# Altium schematic sheet Sheet2.SchDoc
size A; SheetNumber: 1; SheetTotal: 1
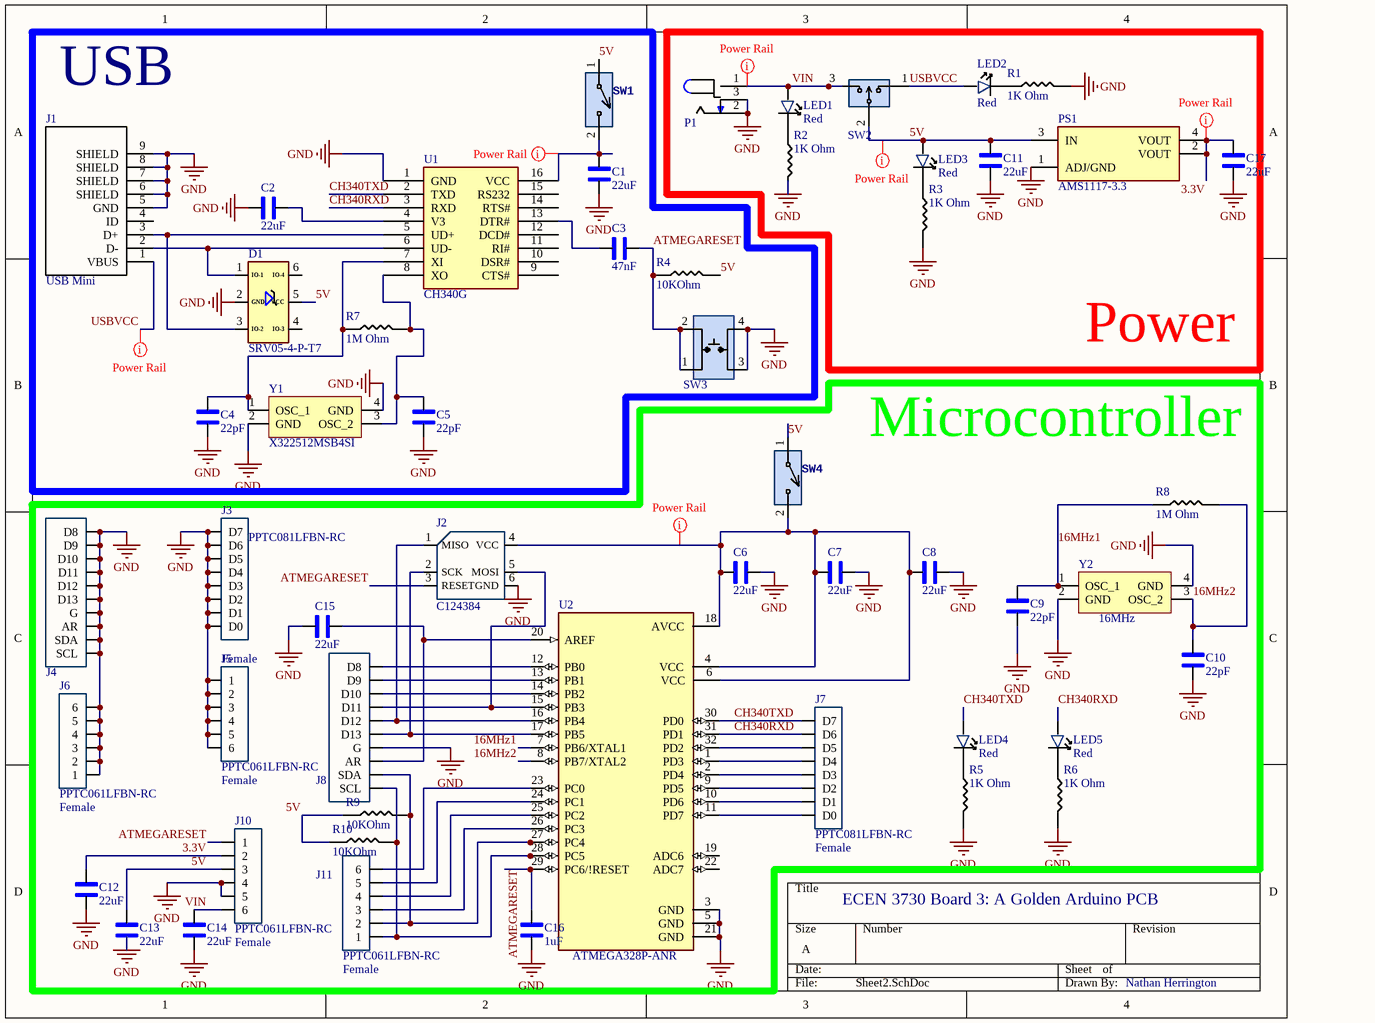
[diagram p0: Sheet2.SchDoc]

## Parts
C1  22uF  [1206_Passive_Capacitor]
C2  22uF  [1206_Passive_Capacitor]
C3  47nF  [1206_Passive_Capacitor]
C4  22pF  [1206_Passive_Capacitor]
C5  22pF  [1206_Passive_Capacitor]
C6  22uF  [1206_Passive_Capacitor]
C7  22uF  [1206_Passive_Capacitor]
C8  22uF  [1206_Passive_Capacitor]
C9  22pF  [1206_Passive_Capacitor]
C10  22pF  [1206_Passive_Capacitor]
C11  22uF  [1206_Passive_Capacitor]
C12  22uF  [1206_Passive_Capacitor]
C13  22uF  [1206_Passive_Capacitor]
C14  22uF  [1206_Passive_Capacitor]
C15  22uF  [1206_Passive_Capacitor]
C16  1uF  [1206_Passive_Capacitor]
C17  22uF  [1206_Passive_Capacitor]
D1  SRV05-4-P-T7  [TVS]
J1  USB Mini  [USB_MINI_B]
J2  LCSC Part#: C124384  [ICSP]  (hidden comment: NRPN032PAEN-RC)
J3  PPTC081LFBN-RC  value Female  [8_PIN_ARD-DIG_100MIL]
J4  PPTC101LFBN-RC  [10_PIN_ARDUINO_100MIL]  (value not drawn)
J5  PPTC061LFBN-RC  value Female  [6_PIN_100MIL -Female]
J6  PPTC061LFBN-RC  value Female  [6_PIN_100MIL -Female]
J7  PPTC081LFBN-RC  value Female  [8_PIN_ARD-DIG_100MIL]
J8  PPTC101LFBN-RC  [10_PIN_ARDUINO_100MIL]  (value not drawn)
J10  PPTC061LFBN-RC  value Female  [6_PIN_100MIL -Female]
J11  PPTC061LFBN-RC  value Female  [6_PIN_100MIL -Female]
LED1  Red  [LED_1206]
LED2  Red  [LED_1206]
LED3  Red  [LED_1206]
LED4  Red  [LED_1206]
LED5  Red  [LED_1206]
P1  Power Jack  [Power_Jack]  (value not drawn)
PS1  AMS1117-3.3  [LDO]
R1  value 1K Ohm  [1206_Passive_Resitor]  (hidden comment: 1k)
R2  value 1K Ohm  [1206_Passive_Resitor]  (hidden comment: 1k)
R3  value 1K Ohm  [1206_Passive_Resitor]  (hidden comment: 1k)
R4  value 10KOhm  [1206_Passive_Resitor]  (hidden comment: 10k)
R5  value 1K Ohm  [1206_Passive_Resitor]  (hidden comment: 1k)
R6  value 1K Ohm  [1206_Passive_Resitor]  (hidden comment: 1k)
R7  value 1M Ohm  [1206_Passive_Resitor]  (hidden comment: 1M)
R8  value 1M Ohm  [1206_Passive_Resitor]  (hidden comment: 1M)
R9  value 10KOhm  [1206_Passive_Resitor]  (hidden comment: 10k)
R10  value 10KOhm  [1206_Passive_Resitor]  (hidden comment: 10k)
SW1  SW_2Pin_100mil_Switch  [2Pin-Header-Conn]  (value not drawn)
SW2  PREC003SAAN-RC  [3_PIN_100mil]  (value not drawn)
SW3  TL3305AF160QG  [Switch_JLC]  (value not drawn)
SW4  SW_2Pin_100mil_Switch  [2Pin-Header-Conn]  (value not drawn)
U1  CH340G  [USB to serial]
U2  ATMEGA328P-ANR  [ATMega328P]
Y1  X322512MSB4SI  [Crystal resonator]
Y2  value 16MHz  [Crystal resonator]  (hidden comment: X322516MLB4SI)

## Blocks framed on the sheet
USB: C1-C5 D1 J1 R4 R7 SW1 SW3 U1 Y1
Power: C11 C17 LED1-LED3 P1 PS1 R1-R3 SW2
Microcontroller: C6-C10 C12-C16 J2-J8 J10 J11 LED4 LED5 R5 R6 R8-R10 SW4 U2 Y2

## Nets
GND: C1.2 C2.1 C4.1 C5.1 C6.2 C7.2 C8.2 C9.2 C10.2 C11.1 C12.2 C13.2 C14.1 C15.1 C16.2 C17.1 D1.2(GND) J1.5(GND) J1.6(SHIELD) J1.7(SHIELD) J1.8(SHIELD) J1.9(SHIELD) J2.6(GND) J3.1(D7) J3.2(D6) J3.3(D5) J3.4(D4) J3.5(D3) J3.6(D2) J3.7(D1) J3.8(D0) J4.1(SCL) J4.2(SDA) J4.3(AR) J4.4(G) J4.5(D13) J4.6(D12) J4.7(D11) J4.8(D10) J4.9(D9) J4.10(D8) J5.1 J5.2 J5.3 J5.4 J5.5 J5.6 J6.1 J6.2 J6.3 J6.4 J6.5 J6.6 J8.4(G) J10.4 J10.5 P1.2 P1.3 PS1.1(ADJ/GND) R1.2 R2.2 R3.2 R5.2 R6.2 SW3.3 SW3.4 U1.1(GND) U2.3(GND) U2.5(GND) U2.21(GND) Y1.2(GND) Y1.4(GND) Y2.2(GND) Y2.4(GND)
3.3V: C12.1 C17.2 J10.2 PS1.2(VOUT) PS1.4(VOUT)
5V: C11.2 C13.1 D1.5(VCC) J10.3 LED3.1 PS1.3(IN) R4.2 R9.1 R10.1 SW1.1 SW2.2 SW4.1
16MHz1: C9.1 R8.1 U2.7(PB6/XTAL1) Y2.1(OSC_1)
16MHz2: C10.1 R8.2 U2.8(PB7/XTAL2) Y2.3(OSC_2)
ATMEGARESET: C3.2 C16.1 J2.3(RESET) J10.1 R4.1 SW3.1 SW3.2 U2.29(PC6/!RESET)
CH340RXD: J7.2(D6) LED5.1 U1.3(RXD) U2.31(PD1)
CH340TXD: J7.1(D7) LED4.1 U1.2(TXD) U2.30(PD0)
USBVCC: J1.1(VBUS) LED2.1 SW2.1
VIN: C14.2 J10.6 LED1.1 P1.1 SW2.3
NetC1_1: C1.1 SW1.2 U1.16(VCC)
NetC2_2: C2.2 U1.4(V3)
NetC3_1: C3.1 U1.13(DTR#)
NetC4_2: C4.2 R7.1 U1.7(XI) Y1.1(OSC_1)
NetC5_2: C5.2 R7.2 U1.8(XO) Y1.3(OSC_2)
NetC6_1: C6.1 C7.1 C8.1 J2.4(VCC) SW4.2 U2.4(VCC) U2.6(VCC) U2.18(AVCC)
NetC15_2: C15.2 J8.3(AR) U2.20(AREF)
NetD1_1: D1.1(IO-1) J1.2(D-) U1.6(UD-)
NetD1_3: D1.3(IO-2) J1.3(D+) U1.5(UD+)
NetJ2_1: J2.1(MISO) J8.6(D12) U2.16(PB4)
NetJ2_2: J2.2(SCK) J8.5(D13) U2.17(PB5)
NetJ2_5: J2.5(MOSI) J8.7(D11) U2.15(PB3)
NetJ7_3: J7.3(D5) U2.32(PD2)
NetJ7_4: J7.4(D4) U2.1(PD3)
NetJ7_5: J7.5(D3) U2.2(PD4)
NetJ7_6: J7.6(D2) U2.9(PD5)
NetJ7_7: J7.7(D1) U2.10(PD6)
NetJ7_8: J7.8(D0) U2.11(PD7)
NetJ8_1: J8.1(SCL) J11.1 R10.2 U2.28(PC5)
NetJ8_2: J8.2(SDA) J11.2 R9.2 U2.27(PC4)
NetJ8_8: J8.8(D10) U2.14(PB2)
NetJ8_9: J8.9(D9) U2.13(PB1)
NetJ8_10: J8.10(D8) U2.12(PB0)
NetJ11_3: J11.3 U2.26(PC3)
NetJ11_4: J11.4 U2.25(PC2)
NetJ11_5: J11.5 U2.24(PC1)
NetJ11_6: J11.6 U2.23(PC0)
NetLED1_2: LED1.2 R2.1
NetLED2_2: LED2.2 R1.1
NetLED3_2: LED3.2 R3.1
NetLED4_2: LED4.2 R5.1
NetLED5_2: LED5.2 R6.1

Not connected (* = marked no-connect by the designer): D1 4(IO-3) 6(IO-4); J1 4(ID); U1 9(CTS#) 10(DSR#) 11(RI#) 12(DCD#) 14(RTS#) 15(RS232); U2 19(ADC6) 22(ADC7)

## Layout directives
rule Width Constraint [Pref Width = 20mil    Min Width = 20mil    Max Width = 100mil]: 3.3V, 5V, NetC1_1, NetC6_1, USBVCC, VIN

## Notes on the sheet
- ECEN 3730 Board 3: A Golden Arduino PCB
- Nathan Herrington

## Library data of the parts
C1 C2 C6-C8 C11-C15 C17 = C_22uF_1206: 22uF ±10% 25V X5R 1206 Multilayer Ceramic Capacitors MLCC - SMD/SMT RoHS; MFR Part #: CL31A226KAHNNNE; Type: basic; LCSC Part#: C12891; Datasheet: https://datasheet.lcsc.com/lcsc/1811031514_Samsung-Electro-Mechanics-CL31A226KAHNNNE_C12891.pdf; Value: 22uF
C3 = C_47nF_1206: 47nF ±5% 50V C0G 1206 Multilayer Ceramic Capacitors MLCC - SMD/SMT RoHS; MFR Part #: GRM31M5C1H473JA01L; Type: Extended; LCSC Part#: C21812; Datasheet: https://datasheet.lcsc.com/lcsc/1810201313_Murata-Electronics-GRM31M5C1H473JA01L_C21812.pdf; Value: 47nF
C4 C5 C9 C10 = C_22pF_1206: 22pF ±5% 1kV C0G 1206 Multilayer Ceramic Capacitors MLCC - SMD/SMT RoHS; MFR Part #: CC1206JKNPOCBN220; Type: Extended; LCSC Part#: C107174; Datasheet: https://datasheet.lcsc.com/lcsc/1810241219_YAGEO-CC1206JKNPOCBN220_C107174.pdf; Value: 22pF
C16 = C_1uF_1206: MULTILAYER CERAMIC CAPACITORS MLCC - SMD/SMT 1UF 50V 1206 ROHS; MFR Part #: CL31B105KBHNNNE; Type: Basic; Digikey Link: https://www.digikey.com/product-detail/en/C1206C105M4RACTU/399-8150-1-ND/3471873/?itemSeq=304982366; LCSC Part#: C1848; Value: 1uF
D1 = D_TVS_Diode: TVS SOT-23-6 ROHS; Value: TVS DIODE 5.5V 6TSOP; Type: Basic; MFR Part #: SRV05-4-P-T7; LCSC Part#: C85364; Datasheet: https://datasheet.lcsc.com/szlcsc/ProTek-Devices-SRV05-4-P-T7_C85364.pdf
J1 = J_USB_B_Mini: Through Hole USB Connectors RoHS; MFR Part #: 920-462A2021D10102; Value: USB mini B; LCSC Part#: C46398; Datasheet: https://datasheet.lcsc.com/szlcsc/2103081233_Jing-Extension-of-the-Electronic-Co-920-462A2021D10102_C46398.pdf; Type: Extended
J2 = J_ICSP: Connector Header Through Hole 6 position 0.079" (2.00mm); Digikey Link: https://www.digikey.com/product-detail/en/NRPN032PAEN-RC/S5801-03-ND/804955/?itemSeq=304982355; MFR Part #: NRPN032PAEN-RC; Type: Extended
J3 J7 = JF_8_PIN_FEMA_ARD-Dig: 8 Position Header Connector 0.100" (2.54mm) Through Hole Tin; Digikey Link: https://www.digikey.com/product-detail/en/PPTC081LFBN-RC/S7006-ND/810147/?itemSeq=304982354; MFR Part #: PPTC081LFBN-RC; Type: Extended; LCSC Part#: C27438
J4 J8 = JF_10_PIN_FEMA_ARDUINO: 10 Position Header Connector 0.100" (2.54mm) Through Hole Tin; Value: Female; Digikey Link: https://www.digikey.com/product-detail/en/PPTC101LFBN-RC/S7008-ND/810149/?itemSeq=304982352; MFR Part #: PPTC101LFBN-RC; LCSC Part#: C225507; Type: Extended
J5 J6 J10 J11 = JF_6_PIN_FEMALE: 6 Position Header Connector 0.100" (2.54mm) Through Hole Tin; Digikey Link: https://www.digikey.com/product-detail/en/PPTC061LFBN-RC/S7004-ND/810145/?itemSeq=304982353; MFR Part #: PPTC061LFBN-RC; LCSC Part#: C40877; Type: Extended
LED1-LED5 = LED_RED_1206: Red 621~631nm 1206 Light Emitting Diodes (LED) RoHS; MFR Part #: 15-21/R6C-FQ1R1B/2T; Type: Extended; LCSC Part#: C93133; Datasheet: https://datasheet.lcsc.com/szlcsc/1811151241_Everlight-Elec-15-21-R6C-FQ1R1B-2T_C93133.pdf; Value: Red
P1 = P_Power Jack: Power Barrel Connector Jack 2.10mm ID (0.083"), 5.50mm OD (0.217") Through Hole, Right Angle; MFR Part #: PJ-102A; Value: CONN PWR JACK 2X5.5MM SOLDER; Digikey Link: https://www.digikey.com/product-detail/en/PJ-102A/CP-102A-ND/275425/?itemSeq=304982367; LCSC Part#: C136744; Type: Extended
PS1 = PS_AMS_LDO_3v3: LOW DROPOUT REGULATORS(LDO) POSITIVE FIXED 1.3V @ 800MA 15V 3.3V 1A SOT-223 ROHS; Value: IC REG LINEAR 3.3V 800MA SOT223; MFR Part #: AMS1117-3.3; LCSC Part#: C6186; Type: Basic
R1-R3 R5 R6 = R_1K_1206: CHIP RESISTOR - SURFACE MOUNT 1KOHMS ±1% 1/4W 1206 ROHS; MFR Part #: RNCP1206FTD1K00CT; Digikey Link: https://www.digikey.com/product-detail/en/RNCP1206FTD1K00/RNCP1206FTD1K00CT-ND/2240675/?itemSeq=304982373; LCSC Part#: C4410; Type: Basic
R4 R9 R10 = R_10KOhm_1206: 10 kOhms ±5% 0.25W, 1/4W Chip Resistor 1206 (3216 Metric) Automotive AEC-Q200 Thick Film; MFR Part #: RMCF1206FT10K0; Digikey Link: https://www.digikey.com/en/products/detail/stackpole-electronics-inc/RMCF1206FT10K0/1759669; LCSC Part#: C17902; Type: Basic
R7 R8 = R_1M_1206: CHIP RESISTOR - SURFACE MOUNT 1MOHMS ±1% 1/4W 1206 ROHS; MFR Part #: RMCF1206JT1M00; Digikey Link: https://www.digikey.com/product-detail/en/RMCF1206JT1M00/RMCF1206JT1M00CT-ND/1942830/?itemSeq=304982358; LCSC Part#: C17927; Type: Basic
SW1 SW4 = SW_2Pin_100mil_Switch: 2Pin Header; LCSC Part#: C124375; Type: Extended
SW2 = SW_3Pin_100mil_Switch: Connector Header Through Hole 3 position 0.100" (2.54mm); Value: CONN HEADER VERT 3POS 2.54MM; Digikey Link: https://www.digikey.com/product-detail/en/PREC003SAAN-RC/S1012EC-03-ND/2774851/?itemSeq=304982371; MFR Part #: PREC003SAAN-RC; Type: Extended; LCSC Part#: C49257
SW3 = SW_Push_Button_JLC: Tactile Switch SPST-NO Top Actuated Surface Mount; MFR Part #: KH-4.5X4.5X4.3H-STM; LCSC Part#: C2837550; Type: Extended; DataSheet: https://datasheet.lcsc.com/lcsc/2106081532_Shenzhen-Kinghelm-Elec-KH-4.5X4.5X4.3H-STM_C2837550.pdf
U1 = U_USBtoSerial: Transceiver USB 2.0 2Mbps SOP-16_150mil USB ICs RoHS; Datasheet: https://datasheet.lcsc.com/lcsc/2008191806_WCH-Jiangsu-Qin-Heng-CH340G_C14267.pdf; LCSC Part#: C14267; MFR Part #: CH340G; Type: Basic; Value: USB to Serial
U2 = U_ATMega328P: AVR AVR® ATmega Microcontroller IC 8-Bit 20MHz 32KB (16K x 16) FLASH 32-TQFP (7x7); MFR Part #: ATMEGA328P-AU; Value: IC MCU 8BIT 32KB FLASH 32TQFP; Digikey Link: https://www.digikey.com/product-detail/en/ATMEGA328P-ANR/ATMEGA328P-ANRCT-ND/2774230/?itemSeq=304982365; LCSC Part#: C14877; Type: Basic
Y1 = X_12MHz_Res: SMD Crystal Resonators 12MHz ±10ppm SMD-3225_4P RoHS; LCSC Part#: C9002; MFR Part #: X322512MSB4SI; Value: 12MHz; Type: Basic; Datasheet: https://datasheet.lcsc.com/szlcsc/Yangxing-Tech-X322512MSB4SI_C9002.pdf
Y2 = X_16Mhz_Res: ±10ppm 16000000Hz -40℃~85℃ 贴片无源晶振 60Ω 9pF SMD3225-4P Crystals ROHS; LCSC Part#: C13738; MFR Part #: X322516MLB4SI; Type: Basic